# EAGLE design ZLL (EAGLE 9.5.2)
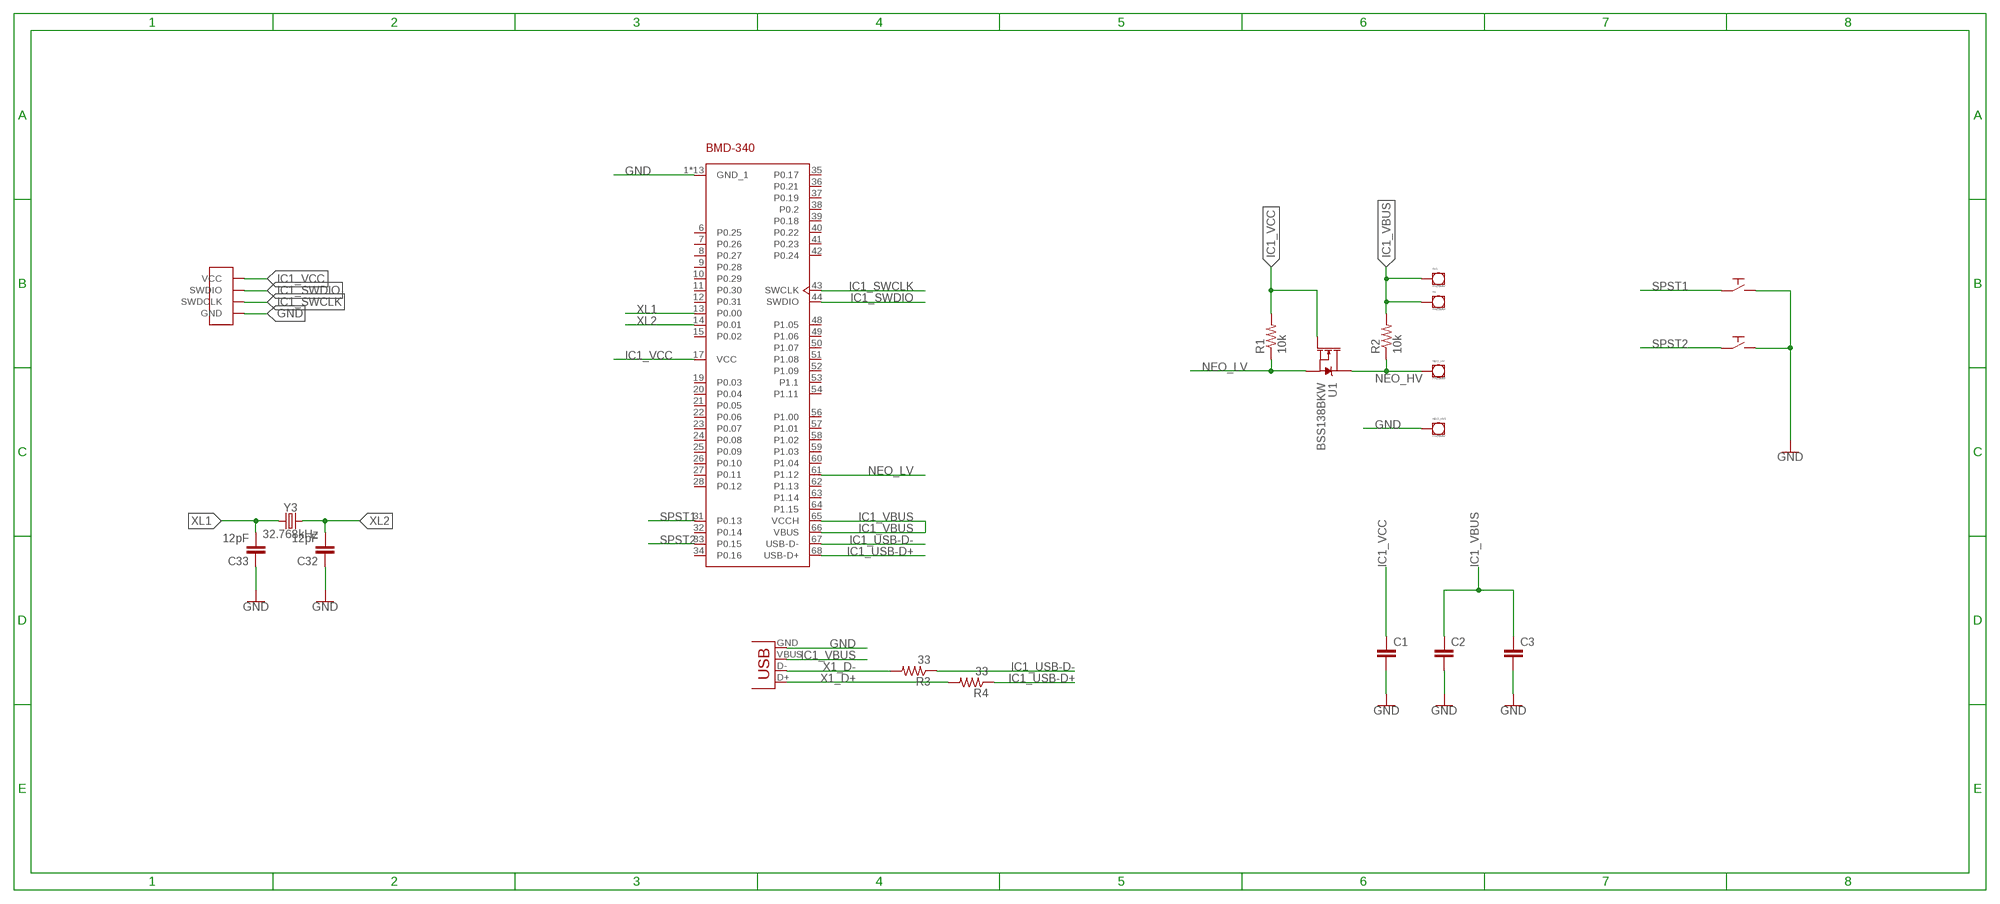
[diagram p0: schematic, sheet 1]

## Parts
5V  PAD3MM  [PAD_3]
5V1  PAD3MM  [PAD_3]
C1  C-EUC0603  [C0603]
C2  C-EUC0805  [C0805]
C3  C-EUC0603  [C0603]
C32  12pF  C-EUC0603  [C0603]
C33  12pF  C-EUC0603  [C0603]
IC1  BMD-340-A-R  [BMD340AR]
NEO_HV  PAD3MM  [PAD_3]
NEO_HV1  PAD3MM  [PAD_3]
R1  10k  R-US_R0603  [R0603]
R2  10k  R-US_R0603  [R0603]
R3  33  R-US_R0603  [R0603]
R4  33  R-US_R0603  [R0603]
SPST1  PTS526SK08  [PTS526SKG15SMTR2LFS]
SPST2  PTS526SK08  [PTS526SKG15SMTR2LFS]
U1  BSS138BKW  [SOT65P210X110-3N]
U$1  PROG_SMD  [PROG_SMD]
X1  USB-MICROB  [USB-MICROB]
Y3  32.768kHz  CRYSTAL-32.768KHZSMD-3.2X1.5  [CRYSTAL-SMD-3.2X1.5MM]

## Nets
GND [power]: C1.2 C2.2 C3.2 C32.1 C33.1 IC1.1(GND_1) IC1.2(GND_1) IC1.3(GND_1) IC1.4(GND_1) IC1.5(GND_1) IC1.16(GND_1) IC1.18(GND_1) IC1.29(GND_1) IC1.30(GND_1) IC1.45(GND_1) IC1.46(GND_1) IC1.47(GND_1) IC1.55(GND_1) NEO_HV1.P$1 SPST1.3 SPST1.4 SPST2.3 SPST2.4 U$1.GND X1.GND
IC1_SWCLK [prog]: IC1.43(SWCLK) U$1.PIN1(SWDCLK)
IC1_SWDIO [prog]: IC1.44(SWDIO) U$1.PIN2(SWDIO)
IC1_USB-D+ [usb]: IC1.68(USB-D+) R4.1
IC1_USB-D- [usb]: IC1.67(USB-D-) R3.1
IC1_VBUS [power]: 5V1.P$1 5V.P$1 C2.1 C3.1 IC1.65(VCCH) IC1.66(VBUS) R2.2 X1.VBUS
IC1_VCC [power]: C1.1 IC1.17(VCC) R1.2 U1.1(G) U$1.VCC
NEO_HV: NEO_HV.P$1 R2.1 U1.3(D)
NEO_LV: IC1.61(P1.12) R1.1 U1.2(S)
SPST1: IC1.31(P0.13) SPST1.1 SPST1.2
SPST2: IC1.33(P0.15) SPST2.1 SPST2.2
X1_D+ [usb]: R4.2 X1.D+
X1_D- [usb]: R3.2 X1.D-
XL1: C33.2 IC1.13(P0.00) Y3.P$1
XL2: C32.2 IC1.14(P0.01) Y3.P$2
Unconnected: IC1.6(P0.25) IC1.7(P0.26) IC1.8(P0.27) IC1.9(P0.28) IC1.10(P0.29) IC1.11(P0.30) IC1.12(P0.31) IC1.15(P0.02) IC1.19(P0.03) IC1.20(P0.04) IC1.21(P0.05) IC1.22(P0.06) IC1.23(P0.07) IC1.24(P0.08) IC1.25(P0.09) IC1.26(P0.10) IC1.27(P0.11) IC1.28(P0.12) IC1.32(P0.14) IC1.34(P0.16) IC1.35(P0.17) IC1.36(P0.21) IC1.37(P0.19) IC1.38(P0.2) IC1.39(P0.18) IC1.40(P0.22) IC1.41(P0.23) IC1.42(P0.24) IC1.48(P1.05) IC1.49(P1.06) IC1.50(P1.07) IC1.51(P1.08) IC1.52(P1.09) IC1.53(P1.1) IC1.54(P1.11) IC1.56(P1.00) IC1.57(P1.01) IC1.58(P1.02) IC1.59(P1.03) IC1.60(P1.04) IC1.62(P1.13) IC1.63(P1.14) IC1.64(P1.15)

## Library data of the parts
5V 5V1 NEO_HV NEO_HV1 = Exposed_pad:PAD: Thing used to expose a pad
C1-C3 = resistor:C-EU: CAPACITOR, European symbol
C32 C33 = rcl:C-EU: CAPACITOR, European symbol
IC1 = Rigado:BMD-340-A-R: Bluetooth Modules (802.15.1) BMD-340-A-R with nRF52840 processor Source: Datasheet <https://componentsearchengine.com/Datasheets/1/BMD-340-A-R.pdf>; DESCRIPTION: Bluetooth Modules (802.15.1) BMD-340-A-R with nRF52840 processor; HEIGHT: 4mm; MANUFACTURER_NAME: Rigado; MANUFACTURER_PART_NUMBER: BMD-340-A-R; MOUSER_PART_NUMBER: 377-BMD-340-A-R
R1-R4 = resistor:R-US_: RESISTOR, American symbol
SPST1 SPST2 = SPST:PTS526SK08: Interrupteurs de contact 50mA 12VDC, 5.2x5.2mm, 0.8mm H, 260gf, G leads, No ground pin, no actuator Button SPST; MTN: 611-PTS526SK08SMTR2L
U1 = BSS138:BSS138BKW: N-channel Trench MOSFET; MPN: BSS138BKW; OC_FARNELL: 2053836; OC_NEWARK: 61T7488; PACKAGE: SOT-23-3; SUPPLIER: NXP
U$1 = Prog:PROG_SMD
X1 = USB:USB: USB Connectors USB-B-PTH is fully proven SKU : PRT-00139 USB-miniB is fully proven SKU : PRT-00587 USB-A-PCB is untested. USB-A-H is throughly reviewed, but untested. Spark Fun Electronics SKU : PRT-00437 USB-B-SMT is throughly reviewed, but untested. Needs silkscreen touching up. USB-A-S has not been used/tested USB-MB-H has not been used/tested
Y3 = Sparkfun-clocks:CRYSTAL-32.768KHZ: 32.768kHz Crystal Frequency: 32.768kHz Frequency Stability: ±20ppm Load Capacitance: 12.5pF (PTH-2X6 & SMD-3.2X1.5), 6pF (SMD-2X6) SparkFun Products: SparkFun BigTime Watch Kit <https://www.sparkfun.com/products/11734> SparkFun nRF52832 Breakout <https://www.sparkfun.com/products/13990> SparkFun Real Time Clock Module <https://www.sparkfun.com/products/12708>; PROD_ID: XTAL-13062

## Net classes
0 default: width 0.203 mm, drill 0.762 mm, clearance 0.178 mm
1 power: width 0.381 mm, drill 0.889 mm, clearance 0.254 mm to class 0
2 usb: width 0.406 mm, drill 0.762 mm, clearance 0.635 mm to class 0, clearance 0.635 mm to class 1, clearance 0.203 mm
3 prog: width 0.203 mm, drill 0.762 mm, clearance 0.508 mm to class 0, clearance 0.508 mm to class 1, clearance 0.508 mm to class 2, clearance 0.178 mm

## Board
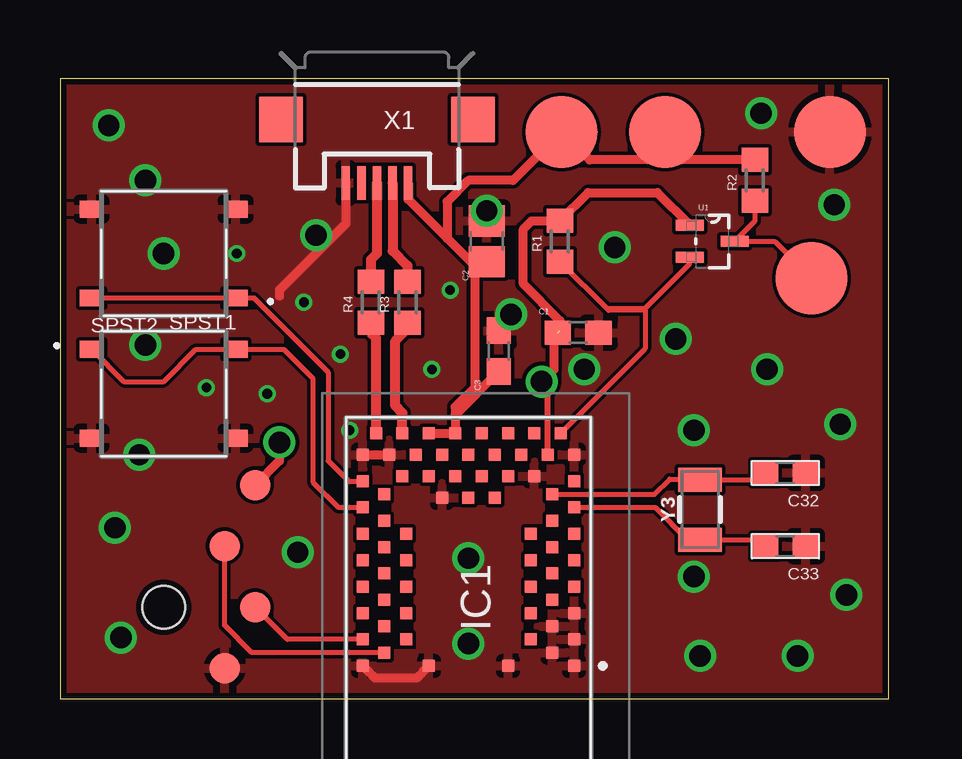
[diagram p1: board, top side]
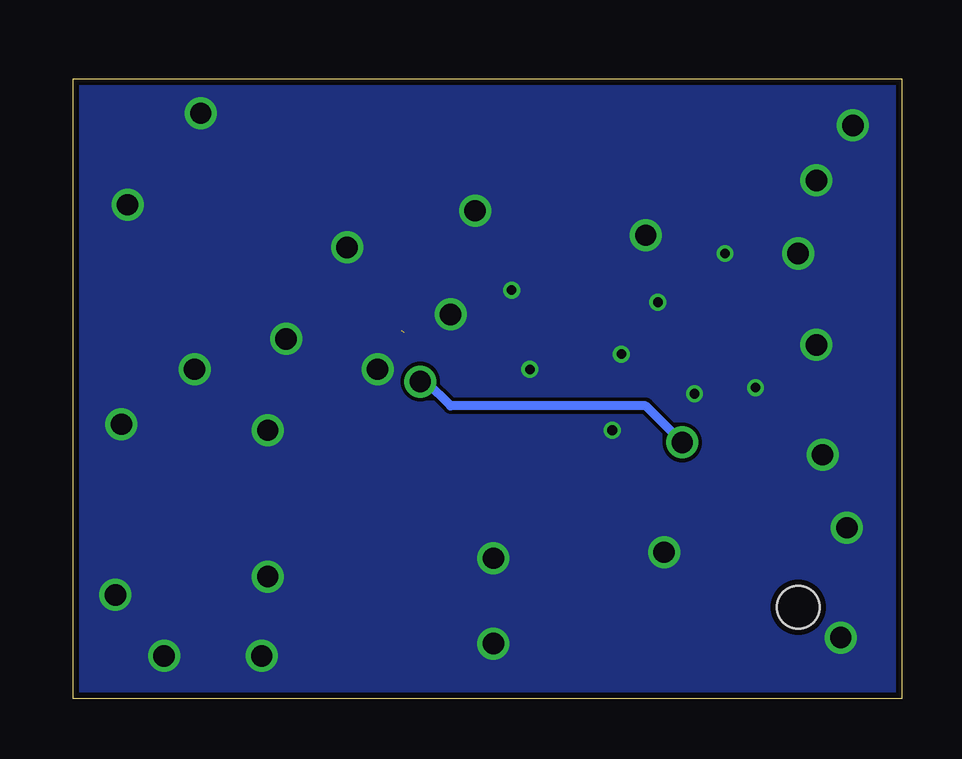
[diagram p2: board, bottom side, seen from below]

Size 34.52 x 25.83 mm. Coordinates in mm from the lower left corner, seen from the top.
Outline: 0,0 34.52,0 34.52,25.83 0,25.83 0,0
Copper layers (1*16): Top 0.035mm / dielectric 1.5mm / Bottom 0.035mm
Design rules "SeeedStudio_2layer_DRU_no_angle_20140221": minimum track width 6mil, minimum drill 12mil, track to track 6mil, track to pad 6mil, pad to pad 6mil, via to via 6mil, smd to smd 0mil, copper to edge 10mil, drill to drill 10mil, minimum pad ring 10mil, minimum via ring 6mil, stop-mask expansion 2mil, vias tented up to drill 100mil, thermal gap 10mil

### Footprints (pad centres in the part's own frame; a part is rotated, then mirrored left to right if it is on the bottom)
PAD_3 = smd 3 x 3: P$1 0.325,1
C0603 = smd 1.1 x 1: 1 -0.85,0; 2 0.85,0
C0805 = smd 1.3 x 1.5: 1 -0.85,0; 2 0.85,0
BMD340AR = smd 0.5 x 0.5: 1 -8.8,-4.4; 2 -8.25,-3.5; 3 -7.7,-4.4; 4 -7.15,-3.5; 5 -6.6,-4.4; 6 -6.05,-3.5; 7 -5.5,-4.4; 8 -4.95,-3.5; 9 -4.4,-4.4; 10 -3.85,-3.5; 11 -3.3,-4.4; 12 -2.75,-3.5; 13 -2.2,-4.4; 14 -1.65,-3.5; 15 -1.1,-4.4; 16 0,-4.4; 17 0,-3.3; 18 -0.9,-2.75; 19 0,-2.2; 20 -0.9,-1.65; 21 0,-1.1; 22 -0.9,-0.55; 23 0,0; 24 -0.9,0.55; 25 0,1.1; 26 -0.9,1.65; 27 0,2.2; 28 -0.9,2.75; 29 0,3.3; 30 0,4.4; 31 -1.1,4.4; 32 -1.65,3.5; 33 -2.2,4.4; 34 -2.75,3.5; 35 -3.3,4.4; 36 -3.85,3.5; 37 -4.4,4.4; 38 -4.95,3.5; 39 -5.5,4.4; 40 -6.05,3.5; 41 -6.6,4.4; 42 -7.15,3.5; 43 -7.7,4.4; 44 -8.25,3.5; 45 -8.8,4.4; 46 -8.8,1.65; 47 -8.8,-1.65; 48 -7.7,-2.6; 49 -6.6,-2.6; 50 -5.5,-2.6; 51 -4.4,-2.6; 52 -3.3,-2.6; 53 -1.8,-1.1; 54 -1.8,0; 55 -1.8,1.1; 56 -3.3,2.6; 57 -4.4,2.6; 58 -5.5,2.6; 59 -6.6,2.6; 60 -7.7,2.6; 61 0.9,-3.85; 62 0.9,-2.75; 63 0.9,-1.65; 64 0.9,-0.55; 65 0.9,0.55; 66 0.9,1.65; 67 0.9,2.75; 68 0.9,3.85
R0603 = smd 1 x 1.1: 1 -0.85,0; 2 0.85,0
PTS526SKG15SMTR2LFS = smd 1 x 0.7: 1 -3,1.85; 2 3,1.85; 3 -3,-1.85; 4 3,-1.85
SOT65P210X110-3N = smd 1.168 x 0.457: 1 -0.94,0.66; 2 -0.94,-0.66; 3 0.94,0
PROG_SMD = smd 1.27 x 1.27: GND 3.81,0; PIN1 1.27,1.27; PIN2 -1.27,0; VCC -3.81,1.27 | hole 1.778: 1.27,-2.54
USB-MICROB = smd 0.35 x 1.4: D+ 0,2.65; D- -0.65,2.65; GND 1.3,2.65; ID 0.65,2.65; VBUS -1.3,2.65 | smd 1.8 x 1.9: MT1 -4,0; MT2 4,0
CRYSTAL-SMD-3.2X1.5MM = smd 1 x 1.8: P$1 -1.25,0; P$2 1.25,0

### Placement (x,y rotation side)
5V  20.57,22.61 0 top
5V1  24.89,22.61 0 top
C1  21.59,15.24 0 top
C2  17.78,19.05 90 top
C3  18.29,14.48 90 top
C32  30.23,9.4 180 top
C33  30.23,6.35 180 top
IC1  17.02,10.16 90 top
NEO_HV  30.99,16.51 0 top
NEO_HV1  31.75,22.61 0 top
R1  20.83,19.05 90 top
R2  28.96,21.59 90 top
R3  14.48,16.51 90 top
R4  12.95,16.51 90 top
SPST1  4.32,18.54 180 top
SPST2  4.32,12.7 0 top
U1  27.18,19.05 0 top
U$1  6.86,5.08 270 top
X1  13.21,24.13 180 top
Y3  26.67,7.87 90 top

### Tracks (layer width: path | path; a pad name or v marks a point on that pad's centre or on a via)
GND  (via drill 0.4, 0.89)
  Top 0.381: X1.GND 11.91,19.78 9.14,17.02 9.14,16.76 | IC1.45 13.13,0.85 14.86,0.85 IC1.46 | IC1.30 IC1.29
  other vias: 3.56,21.59 7.37,18.54 3.56,14.73 6.1,12.95 3.3,10.16 2.54,2.54 26.67,1.78 32.77,4.32 26.42,5.08 32.51,11.43 26.42,11.18 29.46,13.72 21.84,13.72 32.26,20.57 29.21,24.38 17.78,20.32 18.8,16 2.03,23.88 8.64,12.7 10.16,16.51 10.67,19.3 16.26,17.02 30.73,1.78 15.49,13.72 23.11,18.8 25.65,14.99 4.32,18.54 9.91,6.1 2.29,7.11 17.02,2.29 17.02,5.84 12.06,11.18 11.68,14.35
  pour Top: -6.86,22.1 -6.86,26.16 -3.56,29.46 38.1,29.46 41.66,25.91 41.66,-2.29 39.62,-4.32 -3.3,-4.32 -6.86,-0.76
  pour Bottom: -6.35,21.59 -6.35,25.65 -3.05,28.96 38.61,28.96 42.16,25.4 42.16,-2.79 40.13,-4.83 -2.79,-4.83 -6.35,-1.27
IC1_SWCLK
  Top 0.203: IC1.43 9.48,2.46 U$1.PIN1
IC1_SWDIO
  Top 0.203: IC1.44 8,1.91 6.86,3.05 U$1.PIN2
IC1_USB-D+
  Top 0.406: IC1.68 13.17,15.03 12.95,15.24 R4.1
IC1_USB-D-
  Top 0.406: IC1.67 14.27,11.89 13.97,12.19 13.97,14.9 14.48,15.41 R3.1
IC1_VBUS
  Top 0.381: X1.VBUS 14.51,20.8 16.13,19.18 | IC1.65 16.47,12.15 17.27,12.95 17.27,18.03 | 16.13,19.18 17.27,18.03 | IC1.66 IC1.65 | 16.13,19.18 16.13,20.7 17.02,21.59 18.88,21.59 5V.P$1 22.07,22.44 25.15,22.44 | R2.2 25.15,22.44 | C2.1 17.61,18.03 17.27,18.03 | 5V1.P$1 25.22,22.51 25.15,22.44 | C3.1 16.47,11.81 IC1.65
IC1_VCC  (via drill 0.89)  (1 unrouted)
  Top 0.254: IC1.17 20.32,12.95
  Top 0.305: 20.83,15.75 20.83,15.33
  Top 0.381: 20.83,15.75 19.3,17.27 19.3,19.56 19.65,19.9 R1.2 22.01,21.08 24.89,21.08 26.24,19.74 U1.1 | U$1.VCC 9.14,9.91 v9.14,10.67 | 20.32,12.95 v20.07,13.2 v20.07,13.21 20.57,13.72 20.57,15.07 C1.1
  Bottom 0.381: v9.14,10.67 10.67,12.19 18.8,12.19 19.81,13.21 v20.07,13.21
NEO_HV
  Top 0.203: R2.1 28.96,19.89 U1.3 29.77,19.05 NEO_HV.P$1
NEO_LV
  Top 0.203: IC1.61 24.38,14.58 24.38,16.17 22.86,16.17 R1.1 22.77,16.26 24.38,16.26 26.24,18.11 U1.2
SPST1
  Top 0.203: IC1.31 12.02,9.06 11.18,9.91 11.18,13.6 8.08,16.69 SPST1.1 SPST1.2
SPST2
  Top 0.203: IC1.33 11.6,7.96 10.54,9.02 10.54,13.34 9.33,14.55 SPST2.2 5.66,14.55 4.32,13.21 2.66,13.21 SPST2.1
X1_D+
  Top 0.406: X1.D+ 13.21,18.54 12.95,18.29 R4.2
X1_D-
  Top 0.406: X1.D- 13.86,18.65 14.48,18.03 R3.2
XL1
  Top 0.203: IC1.13 24.81,7.96 26.14,6.62 Y3.P$1 29.1,6.62 C33.2
XL2
  Top 0.203: IC1.14 24.77,8.51 25.4,9.14 26.65,9.14 Y3.P$2 29.1,9.12 C32.2